# Altium schematic sheet Op-Amp.SchDoc
size A4
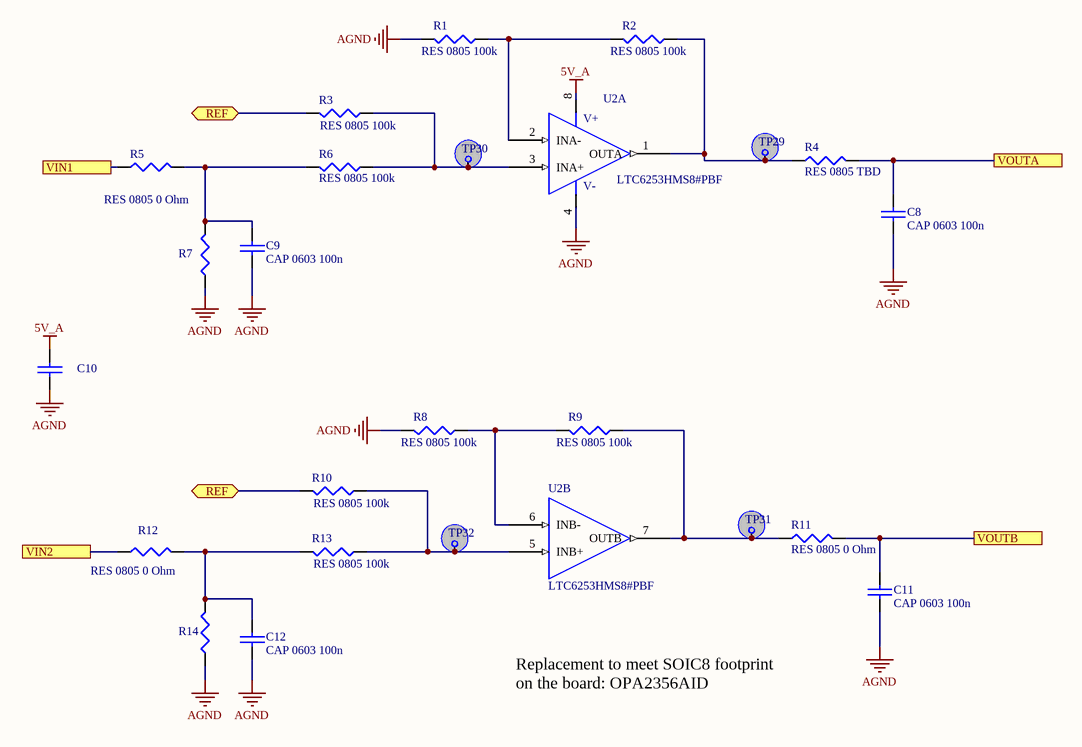
[diagram p0: Op-Amp.SchDoc]

## Parts
C8  CAP 0603 100n  [CAPC1608N]
C9  CAP 0603 100n  [CAPC1608N]
C10  CAP 0603 100nF 100V  [CAPC1608N]  (value not drawn)
C11  CAP 0603 100n  [CAPC1608N]
C12  CAP 0603 100n  [CAPC1608N]
R1  RES 0805 100k  [RES2012N]
R2  RES 0805 100k  [RES2012N]
R3  RES 0805 100k  [RES2012N]
R4  RES 0805 TBD  [RES2012N]
R5  RES 0805 0 Ohm  [RES2012N]
R6  RES 0805 100k  [RES2012N]
R7  RES 0805 10k  [RES2012N]  (value not drawn)
R8  RES 0805 100k  [RES2012N]
R9  RES 0805 100k  [RES2012N]
R10  RES 0805 100k  [RES2012N]
R11  RES 0805 0 Ohm  [RES2012N]
R12  RES 0805 0 Ohm  [RES2012N]
R13  RES 0805 100k  [RES2012N]
R14  RES 0805 10k  [RES2012N]  (value not drawn)
TP29  *  [Keystone 5000]  (value not drawn)
TP30  *  [Keystone 5000]  (value not drawn)
TP31  *  [Keystone 5000]  (value not drawn)
TP32  *  [Keystone 5000]  (value not drawn)
U2  LTC6253HMS8#PBF  [SOIC-8]  (parts A,B of 2)

## Ports
REF, VIN1, VIN2, VOUTA, VOUTB

## Nets
5V_A: C10.2 U2.8(V+)
AGND: C8.2 C9.2 C10.1 C11.2 C12.2 R1.2 R7.1 R8.2 R14.1 U2.4(V-)
REF: R3.2 R10.2 ; port REF
VIN1: R5.1 ; port VIN1
VIN2: R12.1 ; port VIN2
VOUTA: C8.1 R4.2 ; port VOUTA
VOUTB: C11.1 R11.2 ; port VOUTB
NetC9_1: C9.1 R5.2 R6.2 R7.2
NetC12_1: C12.1 R12.2 R13.2 R14.2
NetR1_1: R1.1 R2.2 U2.2(INA-)
NetR2_1: R2.1 R4.1 TP29.1 U2.1(OUTA)
NetR3_1: R3.1 R6.1 TP30.1 U2.3(INA+)
NetR8_1: R8.1 R9.2 U2.6(INB-)
NetR9_1: R9.1 R11.1 TP31.1 U2.7(OUTB)
NetR10_1: R10.1 R13.1 TP32.1 U2.5(INB+)

## Notes on the sheet
- Replacement to meet SOIC8 footprint on the board: OPA2356AID

## Library data of the parts
C8 C10-C12 = CAP 0603 TBD: Vendor: TBD; Part#: TBD; Manuf: TBD; Manuf#: TBD; Cost: TBD
C9 = CAP 0603 TBD: CAP 0603 100 nF; Vendor: TBD; Part#: TBD; Manuf: TBD; Manuf#: TBD; Cost: TBD
R1-R3 R5-R14 = RES 0805 TBD: Manuf#: TBD; Manuf: TBD; Vendor: TBD; Cost@10: TBD; Part#: TBD
TP29-TP32 = TEST_POINT_HOOK
U2 = LTC6253HMS8#PBF: 720MHz, 3.5mA Power / Efficient Rail-to-Rail / I/O Op Amps; Manufacturer: Texas Instruments; GENERIC_PART_NUMBER: OPA2140; Manufacturer_Part_Number: opa2140_d_8; INDUSTRY_STD_PKG_TYPE: SOIC; FAMILY_NAME: LOW INPUT BIAS CURRENT/FET INPUT; PIN_COUNT: 8; PACKAGE_DESIGNATOR: D; Datasheet URL: http://www.ti.com/lit/gpn/OPA2140; Vendor: Texas Instruments; RefDes: RefDes; Type: DEV; Value: Value
R4 = RES 0805 TBD: Manuf#: TBD; Manuf: TBD; Vendor: TBD; Cost@10: TBD; Part#: TBD